# Altium project Unrouted_Pet_IOT_PCB.PrjPcb
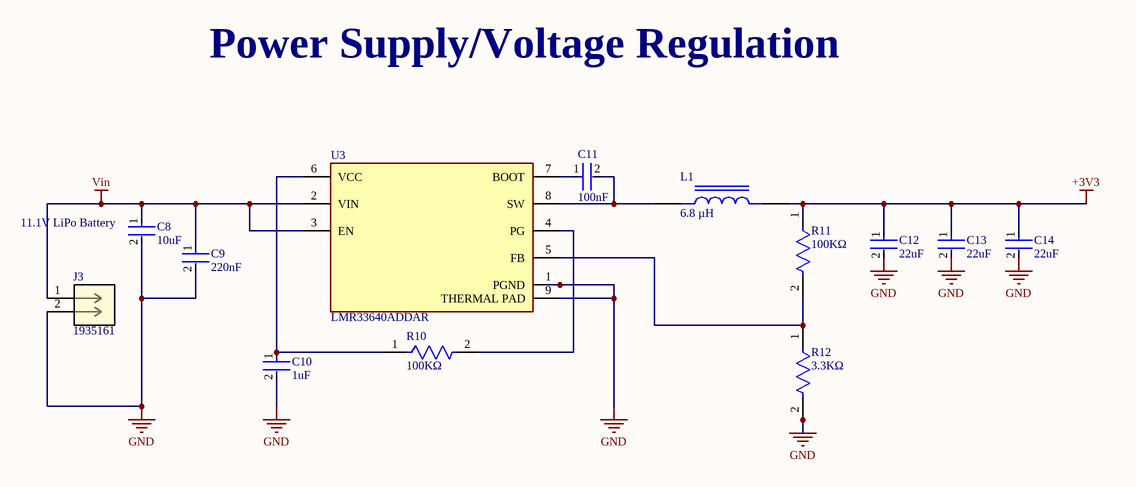
[diagram p0: PowerSupply.SchDoc]
3 sheets, 35 parts. Net scope: global (net labels, ports and power ports of the same name join across sheets).
Board file: PetTrackerPCB.PcbDoc
Sheets:
  PowerSupply.SchDoc
  Dataflow.SchDoc
  EC25.SchDoc

## Sheet PowerSupply.SchDoc
size A4; SheetNumber: 1; SheetTotal: 3

### Parts
C8  10uF  [FP-CL21-IPC_A]
C9  220nF  [FP-CL21-IPC_B]
C10  1uF  [FP-CL10-IPC_C]
C11  100nF  [FP-CL21-IPC_C]
C12  22uF  [FP-CL21-IPC_C]
C13  22uF  [FP-CL21-IPC_C]
C14  22uF  [FP-CL21-IPC_C]
J3  1935161  [CONN_1935161_PXC]
L1  6.8 µH  [IND_SRN8040TA-6R8M]
R10  100KΩ  [FP-CRGP2512-IPC_C]
R11  100KΩ  [FP-CRGP2512-IPC_C]
R12  3.3KΩ  [FP-CRGP2512-IPC_C]
U3  LMR33640ADDAR  [FP-DDA0008J-IPC_A]

### Nets
+3V3: C12.1 C13.1 C14.1 L1.2 R11.1
GND: C8.2 C9.2 C10.2 C12.2 C13.2 C14.2 J3.2 R12.2 U3.1(PGND) U3.9(THERMAL_PAD)
Vin: C8.1 C9.1 J3.1 U3.2(VIN) U3.3(EN)
NetC10_1: C10.1 R10.1 U3.6(VCC)
NetC11_1: C11.1 U3.7(BOOT)
NetC11_2: C11.2 L1.1 U3.8(SW)
NetR10_2: R10.2 U3.4(PG)
NetR11_2: R11.2 R12.1 U3.5(FB)

### Notes on the sheet
- Power Supply/Voltage Regulation
- (near C8) 11.1V LiPo Battery

### Library data of the parts
C8 = CMP-13271-002975-1: CL21A106KAYNNNE CL21 Series 0805 10uF 25V ±10% Tolerance X5R Multilayer Ceramic Chip Capacitor; Case Code (Imperial): 0805; Length: 2mm; Case/Package: 0805; Packaging: Tape and Reel; Width: 0.049inch; Tolerance: 10%; Mount: Surface Mount; Min Operating Temperature: -55°C; Thickness: 0.057inch; Height: 1.25mm; Dielectric: X5R; Package Quantity: 1; Depth: 1.25mm; Capacitance: 10uF; Voltage Rating: 25V; Case Code (Metric): 2012; Max Operating Temperature: 85°C; Radiation Hardening: No
C9 = CMP-13271-002523-1: CL21B224KAFNNNE CL21 Series 0805 220nF 25V ±10% Tolerance X7R Multilayer Ceramic Chip Capacitor; Depth: 1.25mm; Case/Package: 0805; Mount: Surface Mount; Length: 2mm; Voltage Rating: 25V; Dielectric: X7R; Max Operating Temperature: 125°C; Thickness: 0.053inch; Case Code (Metric): 2012; Capacitance: 220nF; Package Quantity: 1; Radiation Hardening: No; Height: 1.25mm; Tolerance: 10%; Contact Plating: Tin; Packaging: Tape and Reel; Case Code (Imperial): 0805; Min Operating Temperature: -55°C; Width: 0.049inch
C10 = CMP-13271-004127-1: CL10A105KA8NNNC Cap Ceramic 1uF 25V X5R ±10% Pad SMD 0603 +85°C T/R; Height: 0.8mm; Capacitance: 1uF; Depth: 0.8mm; Package Quantity: 1; Mount: Surface Mount; Contact Plating: Tin; Voltage Rating: 25V; Dielectric: X5R; Packaging: Tape and Reel; Material: Ceramic; Case Code (Metric): 1608; Length: 1.6mm; Voltage: 25V; Min Operating Temperature: -55°C; Width: 0.031inch; Tolerance: 10%; Case/Package: 0603; Radiation Hardening: No; Case Code (Imperial): 0603; Thickness: 0.035inch; Lead Free: Lead Free; Max Operating Temperature: 85°C; Voltage Rating (DC): 25V
C11 = CMP-13271-002854-1: CL21B104KACNNNC CL21 Series 0805 100nF 25V ±10% Tolerance X7R Multilayer Ceramic Chip Capacitor; Thickness: 0.037inch; Dielectric: X7R; Packaging: Tape and Reel; Height: 0.85mm; Case/Package: 0805; Mount: Surface Mount; Case Code (Imperial): 0805; Capacitance: 100nF; Case Code (Metric): 2012; Length: 2mm; Voltage Rating: 25V; Voltage: 25V; Contact Plating: Tin; Tolerance: 10%; Max Operating Temperature: 125°C; Width: 0.049inch; Min Operating Temperature: -55°C; Radiation Hardening: No; Package Quantity: 1; Depth: 1.25mm
C12-C14 = CMP-13271-003225-1: CL21A226MAYNNNE CL21 Series 0805 22uF 25V ±20% Tolerance X5R Multilayer Ceramic Chip Capacitor
J3 = 1935161: Ceramic Capacitor, Multilayer, Ceramic, 16V, 10% +Tol, 10% -Tol, X5R, 15% TC, 10uF, Surface Mount, 0805; Mfr_Name: Phoenix Contact; Manufacturer: Samsung; Manufacturer Part Number: CL21A106KOQNNNE; Multilayer: Yes; RefDes: RefDes; Type: Type; Supplier: Digikey; Supplier Part Number: 1276-1096-1-ND; RoHS: Yes; Category: Ceramic Capacitors; Stock: 3573508; Pricing: 1=0.1, 10=0.07, 50=0.0404, 100=0.0313, 500=0.02354, 1000=0.0185 (USD); Mounting Technology: Surface Mount; Pins: 2; Dielectric Material: Ceramic; Package Shape: Rectangular; Case/Package: 0805; Terminal Finish: Nickel; Min Operating Temperature: -55°C; Max Operating Temperature: 85°C; JESD-609 Code: e3; Value: 10uF; Capacitor Type: Ceramic; Tolerance  (fill in as +-): 10%; Package Style: SMTMeter; Packaging: Tape and Reel; Tolerance (fill in as +-): 10%; Rated DC Voltage (URdc): 16V; Temperature Characteristics Code: X5R; Termination: Wraparound; Length: 2mm; Width: 1.25mm; Height: 1.4mm; Reach SVHC Compliant: Yes; RoHS Compliant: Yes; ComponentLink1URL: https://datasheet.ciiva.com:443/pdfs/VipMasterIC/IC/SEMS/SEMS-S-A0008520559/SEMS-S-A0008520510-1.pdf?src-supplier=IHS+Markit; ComponentLink1Description: https://datasheet.ciiva.com:443/pdfs/VipMasterIC/IC/SEMS/SEMS-S-A0008520559/SEMS-S-A0008520510-1.pdf?src-supplier=IHS+Markit; ComponentLink2URL: https://datasheet.ciiva.com/15216/getdatasheetpartid-358435-15216234.pdf?src-supplier=Verical; ComponentLink2Description: https://datasheet.ciiva.com/15216/getdatasheetpartid-358435-15216234.pdf?src-supplier=Verical; ComponentLink3URL: https://datasheet.ciiva.com/25798/cl21a106koqnnne-25798133.pdf?src-supplier=Digikey; ComponentLink3Description: https://datasheet.ciiva.com/25798/cl21a106koqnnne-25798133.pdf?src-supplier=Digikey
L1 = SRN8040TA-6R8M: SRN8040TA-6R8M FIXED IND 6.8UH 5.1A 25 MOHM SMD; Package: None; Price: None; Value: *; MP: SRN8040TA-6R8M; Availability: Unavailable
R10 R11 = CMP-03211-001791-1: CRGP2512F100K CRGP2512 100KΩ 2W ±100ppm/°C 1% 500V; Manufacturer: TE; Tolerance: 0.01; Ambient Temperature Range High: +70°C; Package: CRGP2512; Lead Free: Yes; ComponentLink2URL: https://www.mouser.ca/datasheet/2/418/NG_DS_9-1773463-9_A-1358566.pdf; Device Class L2: Resistors; Ipc Land Pattern Name: RESC635320X55; Temperature Coefficient: ±100ppm/°C; Voltage Rating: 500V; Temperature: -55°C to +155°C; Category: Res; Composition: Thick Film; Octopart: https://octopart.com/crgp2512f100k-te+connectivity-91019024; RoHS: TRUE; Power Rating: 2W; Device Class L1: Passive Components; Temperature Range High: +155°C; Temperature Range Low: -55°C; Series: CRGP; Device Class L3: Chip SMD Resistors; Manufacturer Part Number: CRGP2512F100K; Height: 0.65mm; Resistance: 100KΩ; Value: 100KΩ; ComponentLink2Description: Datasheet; Automotive: No
R12 = CMP-03211-004979-1: CRGP2512F3K3 CRGP2512 3.3KΩ 2W ±100ppm/°C 1% 500V; Manufacturer: TE; Tolerance: 0.01; Height: 0.65mm; RoHS: TRUE; Power Rating: 2W; Package: CRGP2512; Device Class L3: Chip SMD Resistors; Temperature Coefficient: ±100ppm/°C; Lead Free: Yes; Automotive: No; Category: Res; Octopart: https://octopart.com/crgp2512f3k3-te+connectivity-91019064; Composition: Thick Film; Series: CRGP; Resistance: 3.3KΩ; Temperature Range High: +155°C; Ambient Temperature Range High: +70°C; Manufacturer Part Number: CRGP2512F3K3; Temperature Range Low: -55°C; Device Class L2: Resistors; Value: 3.3KΩ; Temperature: -55°C to +155°C; ComponentLink2URL: https://www.mouser.ca/datasheet/2/418/NG_DS_9-1773463-9_A-1358566.pdf; Ipc Land Pattern Name: RESC635320X55; Voltage Rating: 500V; Device Class L1: Passive Components; ComponentLink2Description: Datasheet
U3 = CMP-04918-000399-1: 36V 4A 400KHZ REGULATOR

## Sheet Dataflow.SchDoc
size A3; SheetNumber: 2; SheetTotal: 3
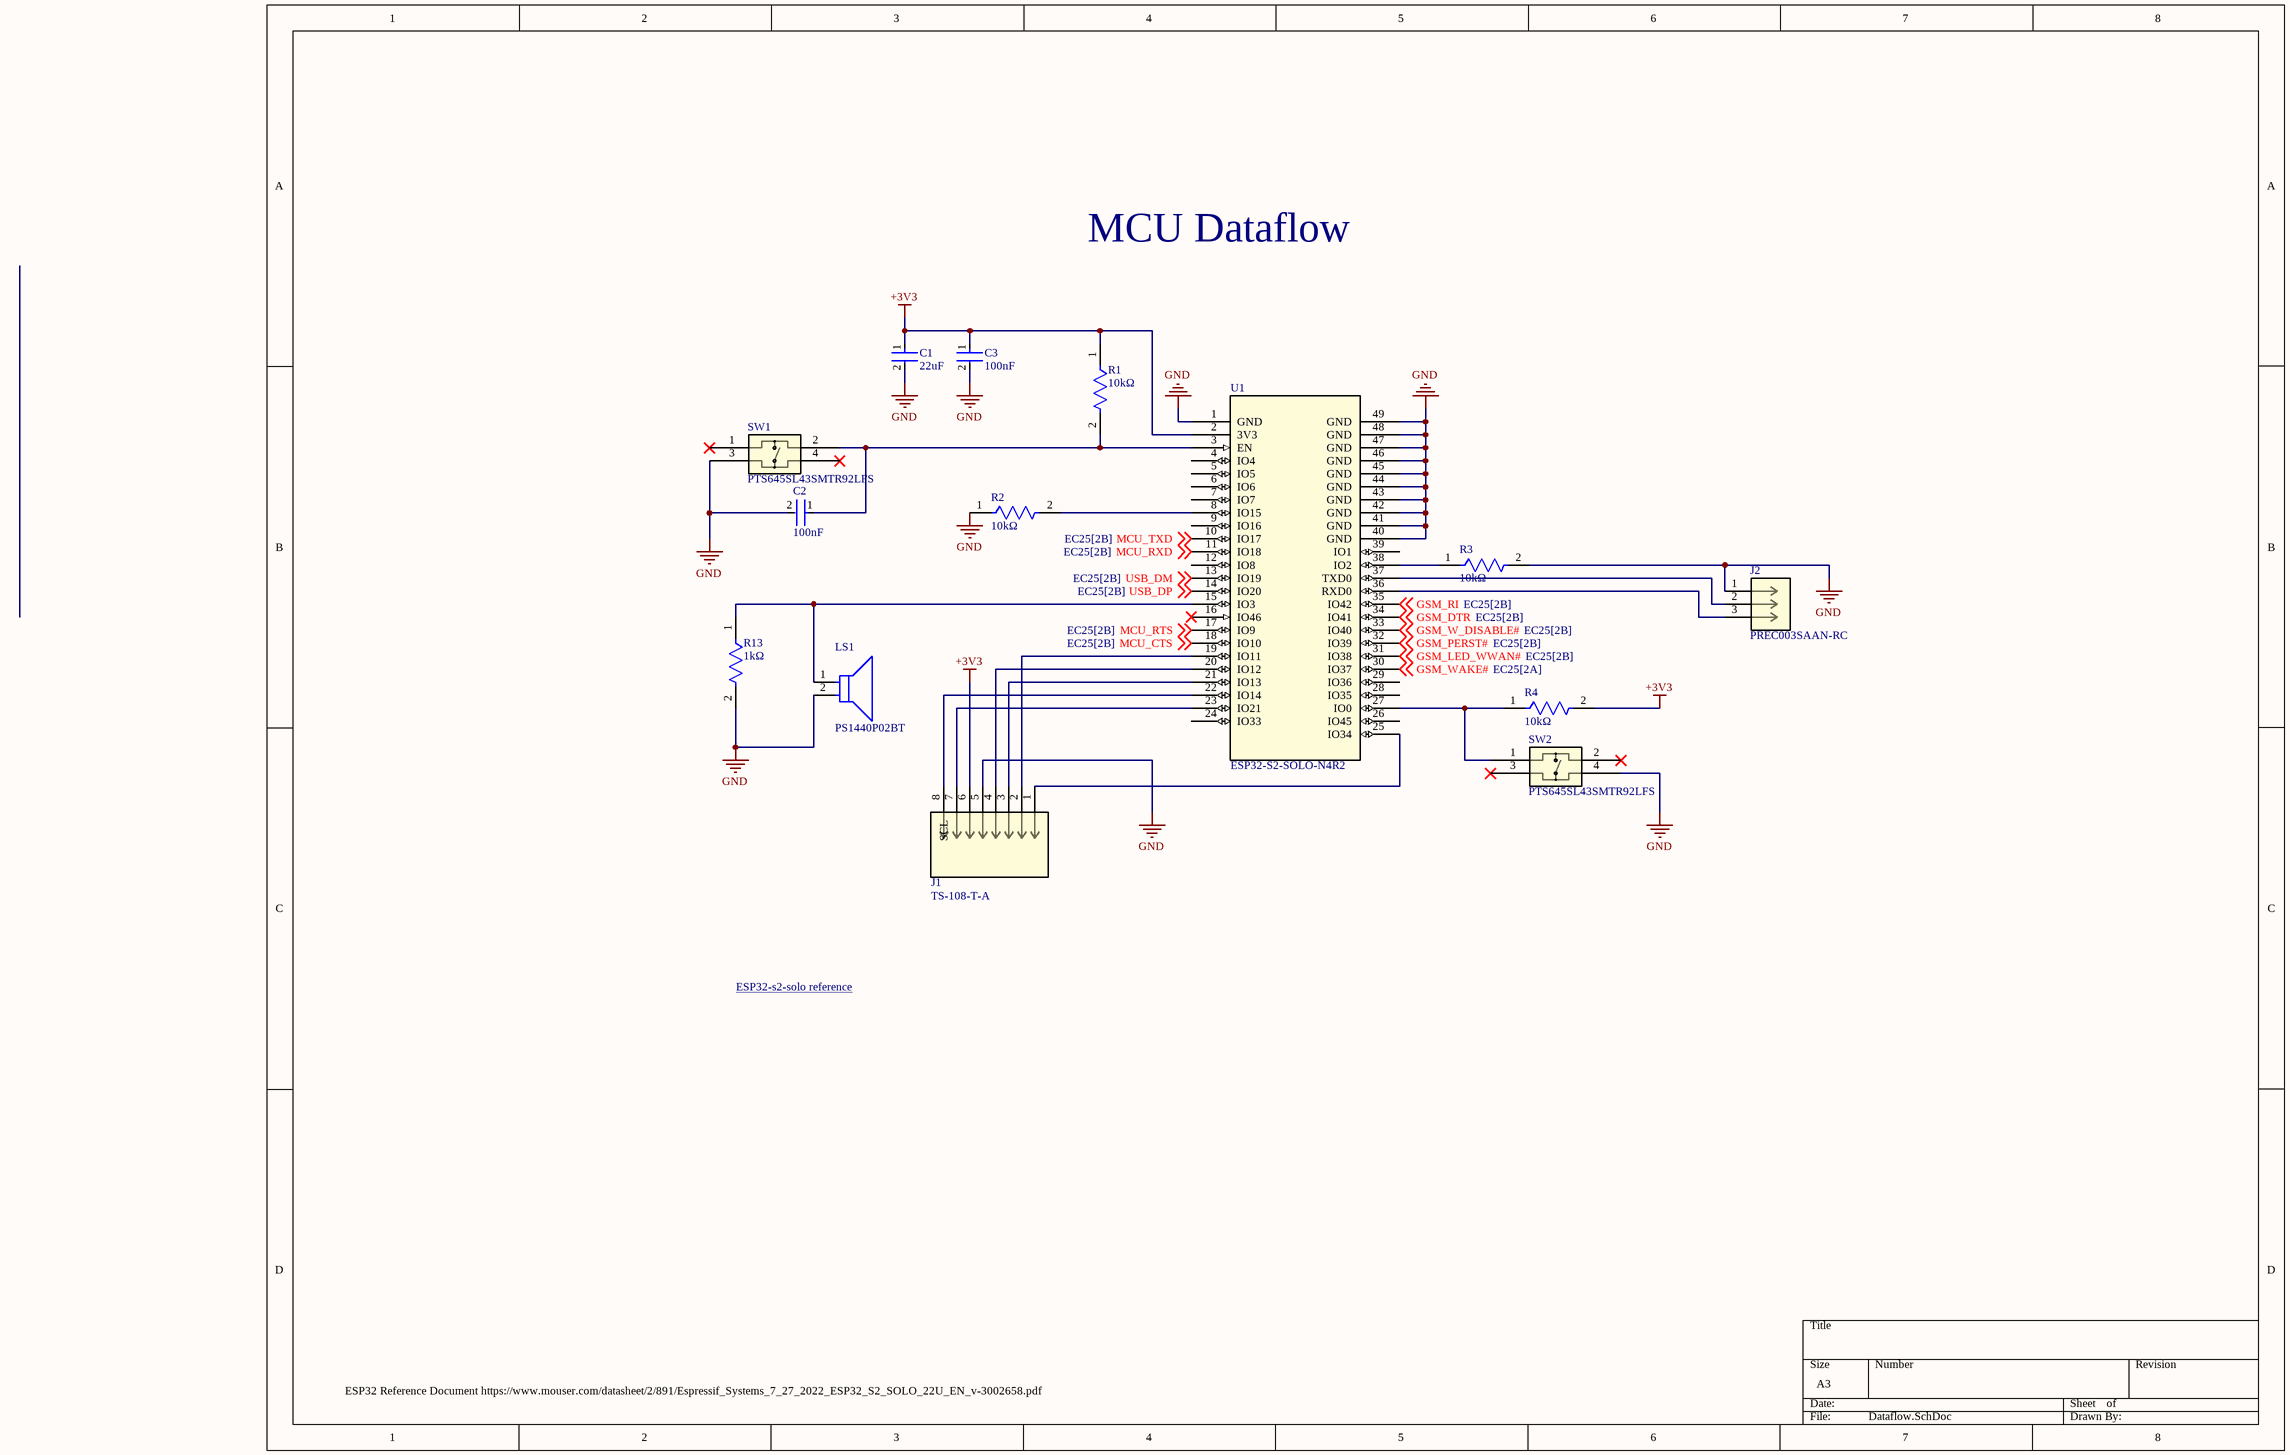
[diagram p1: Dataflow.SchDoc]

### Parts
C1  22uF  [FP-CL21-IPC_C]
C2  100nF  [FP-CL21-IPC_C]
C3  100nF  [FP-CL21-IPC_C]
J1  TS-108-T-A  [CON8_1X8_TU_HTS_SAI]
J2  PREC003SAAN-RC  [CONN_PREC003SAAN-RC_SUL]
LS1  PS1440P02BT  [FP-PS1440P02BT-MFG]
R1  10kΩ  [FP-CRGP2512-IPC_C]
R2  10kΩ  [FP-CRGP2512-IPC_C]
R3  10kΩ  [FP-CRGP2512-IPC_C]
R4  10kΩ  [FP-CRGP2512-IPC_C]
R13  1kΩ  [FP-CRGP2512-IPC_C]
SW1  PTS645SL43SMTR92LFS  [PTS645SL43SMTR92LFS_CNK]
SW2  PTS645SL43SMTR92LFS  [PTS645SL43SMTR92LFS_CNK]
U1  ESP32-S2-SOLO-N4R2  [MOD41_ESP32-S2-SOLO_EXP]

### Nets
+3V3: C1.1 C3.1 J1.6(+3V3) R1.1 R4.2 U1.2(3V3)
GND: C1.2 C2.2 C3.2 J1.5(GND) J2.1 LS1.2 R2.1 R3.2 R13.2 SW1.3 SW2.4 U1.1(GND) U1.40(GND) U1.41(GND) U1.42(GND) U1.43(GND) U1.44(GND) U1.45(GND) U1.46(GND) U1.47(GND) U1.48(GND) U1.49(GND)
GSM_DTR: U1.34(IO41) ; off-sheet GSM_DTR
GSM_LED_WWAN#: U1.31(IO38) ; off-sheet GSM_LED_WWAN#
GSM_PERST#: U1.32(IO39) ; off-sheet GSM_PERST#
GSM_RI: U1.35(IO42) ; off-sheet GSM_RI
GSM_W_DISABLE#: U1.33(IO40) ; off-sheet GSM_W_DISABLE#
GSM_WAKE#: U1.30(IO37) ; off-sheet GSM_WAKE#
MCU_CTS: U1.18(IO10) ; off-sheet MCU_CTS
MCU_RTS: U1.17(IO9) ; off-sheet MCU_RTS
MCU_RXD: U1.11(IO18) ; off-sheet MCU_RXD
MCU_TXD: U1.10(IO17) ; off-sheet MCU_TXD
USB_DM: U1.13(IO19) ; off-sheet USB_DM
USB_DP: U1.14(IO20) ; off-sheet USB_DP
NetC2_1: C2.1 R1.2 SW1.2 U1.3(EN)
NetJ1_1: J1.1(CS) U1.25(IO34)
NetJ1_2: J1.2(MOSI) U1.19(IO11)
NetJ1_3: J1.3(MISO) U1.21(IO13)
NetJ1_4: J1.4(SCLK) U1.20(IO12)
NetJ1_7: J1.7(SDA) U1.23(IO21)
NetJ1_8: J1.8(SCL) U1.22(IO14)
NetJ2_2: J2.2 U1.37(TXD0)
NetJ2_3: J2.3 U1.36(RXD0)
NetLS1_1: LS1.1 R13.1 U1.15(IO3)
NetR2_2: R2.2 U1.8(IO15)
NetR3_1: R3.1 U1.38(IO2)
NetR4_1: R4.1 SW2.1 U1.27(IO0)

Not connected (* = marked no-connect by the designer): SW1 1* 4*; SW2 2* 3*; U1 4(IO4) 5(IO5) 6(IO6) 7(IO7) 9(IO16) 12(IO8) 16(IO46)* 24(IO33) 26(IO45) 28(IO35) 29(IO36) 39(IO1)

### Notes on the sheet
- MCU Dataflow
- ESP32-s2-solo reference <https://www.espressif.com/sites/default/files/documentation/esp32-s2-solo-2_esp32-s2-solo-2u_datasheet_en.pdf>
- ESP32 Reference Document https://www.mouser.com/datasheet/2/891/Espressif_Systems_7_27_2022_ESP32_S2_SOLO_22U_EN_v-3002658.pdf

### Library data of the parts
C1 = CMP-13271-003225-1: as C12 on sheet PowerSupply
C2 C3 = CMP-13271-002854-1: as C11 on sheet PowerSupply; Thickness: 0.037inch; Dielectric: X7R; Packaging: Tape and Reel; Height: 0.85mm; Case/Package: 0805; Mount: Surface Mount; Case Code (Imperial): 0805; Capacitance: 100nF; Case Code (Metric): 2012; Length: 2mm; Voltage Rating: 25V; Voltage: 25V; Contact Plating: Tin; Tolerance: 10%; Max Operating Temperature: 125°C; Width: 0.049inch; Min Operating Temperature: -55°C; Radiation Hardening: No; Package Quantity: 1; Depth: 1.25mm
J1 = TS-108-T-A: No Description Available; Mfr_Name: Samtec Inc; RefDes: RefDes; Type: Type
J2 = PREC003SAAN-RC: No Description Available; Mfr_Name: Sullins; Digi-Key_Part_Number_1: S1012EC-03-ND; RefDes: RefDes; Type: Type
LS1 = CMP-08413-000003-1: AUDIO PIEZO TRANSDUCER 30V TH; Self Resonant Frequency: 4kHz; Washable: No; Voltage Rating (DC): 3V; Number of Terminals/Pins: 2; Packaging: Tape and Reel; Lead Free: Lead Free; Min Operating Temperature: -10°C; Package Quantity: 350; Termination: PC Pins; Mount: Through Hole; Max Operating Temperature: 70°C; Operating Supply Voltage: 3V; Diameter: 14mm; RoHS Compliant: Yes; Frequency: 4kHz; Height: 8mm
R1-R4 = CMP-03211-007941-1: CRGP2512F10K CRGP 2512 10K 1%; Manufacturer: TE; Voltage Rating: 500V; Tolerance: 0.01; Temperature Coefficient: ±100ppm/°C; Description: CRGP2512 10KΩ 2W ±100ppm/°C 1% 500V; Power Rating: 2W; ComponentLink2Description: Datasheet; Series: CRGP; Temperature: -55°C to +155°C; ComponentLink2URL: https://www.mouser.ca/datasheet/2/418/NG_DS_9-1773463-9_A-1358566.pdf; Device Class L3: Chip SMD Resistors; Temperature Range High: +155°C; Ipc Land Pattern Name: RESC635320X55; Manufacturer Part Number: CRGP2512F10K; Height: 0.65mm; RoHS: TRUE; Ambient Temperature Range High: +70°C; Lead Free: Yes; Composition: Thick Film; Device Class L1: Passive Components; Automotive: No; Octopart: https://octopart.com/crgp2512f10k-te+connectivity-91019026; Digikey Description: CRGP 2512 10K 1%; Value: 10KΩ; Package: CRGP2512; Temperature Range Low: -55°C; Resistance: 10KΩ; Category: Res; Device Class L2: Resistors
R13 = CMP-03211-007859-1: CRGP2512F1K0 Res, 1K, 1%, 2W, 2512, Thick Film; Manufacturer: TE; Temperature Coefficient: ±100ppm/°C; Voltage Rating: 500V; Description: CRGP2512 1KΩ 2W ±100ppm/°C 1% 500V; Tolerance: 0.01; Power Rating: 2W; Composition: Thick Film; Temperature Range Low: -55°C; Device Class L3: Chip SMD Resistors; Value: 1KΩ; Device Class L2: Resistors; Device Class L1: Passive Components; Temperature: -55°C to +155°C; Category: Res; Automotive: No; Manufacturer Part Number: CRGP2512F1K0; Ipc Land Pattern Name: RESC635320X55; Digikey Description: Res, 1K, 1%, 2W, 2512, Thick Film; Height: 0.65mm; Octopart: https://octopart.com/crgp2512f1k0-te+connectivity-91019040; Package: CRGP2512; Series: CRGP; Ambient Temperature Range High: +70°C; Lead Free: Yes; Resistance: 1KΩ; Temperature Range High: +155°C; RoHS: TRUE; ComponentLink2Description: Datasheet; ComponentLink2URL: https://www.mouser.ca/datasheet/2/418/NG_DS_9-1773463-9_A-1358566.pdf
SW1 SW2 = PTS645SL43SMTR92LFS: No Description Available; Mfr_Name: C&K Components; RefDes: RefDes; Type: Type
U1 = ESP32-S2-SOLO-N4R2: No Description Available; Mfr_Name: Espressif Systems; Type: RF; RefDes: RefDes

## Sheet EC25.SchDoc
size A4; SheetNumber: 3; SheetTotal: 3
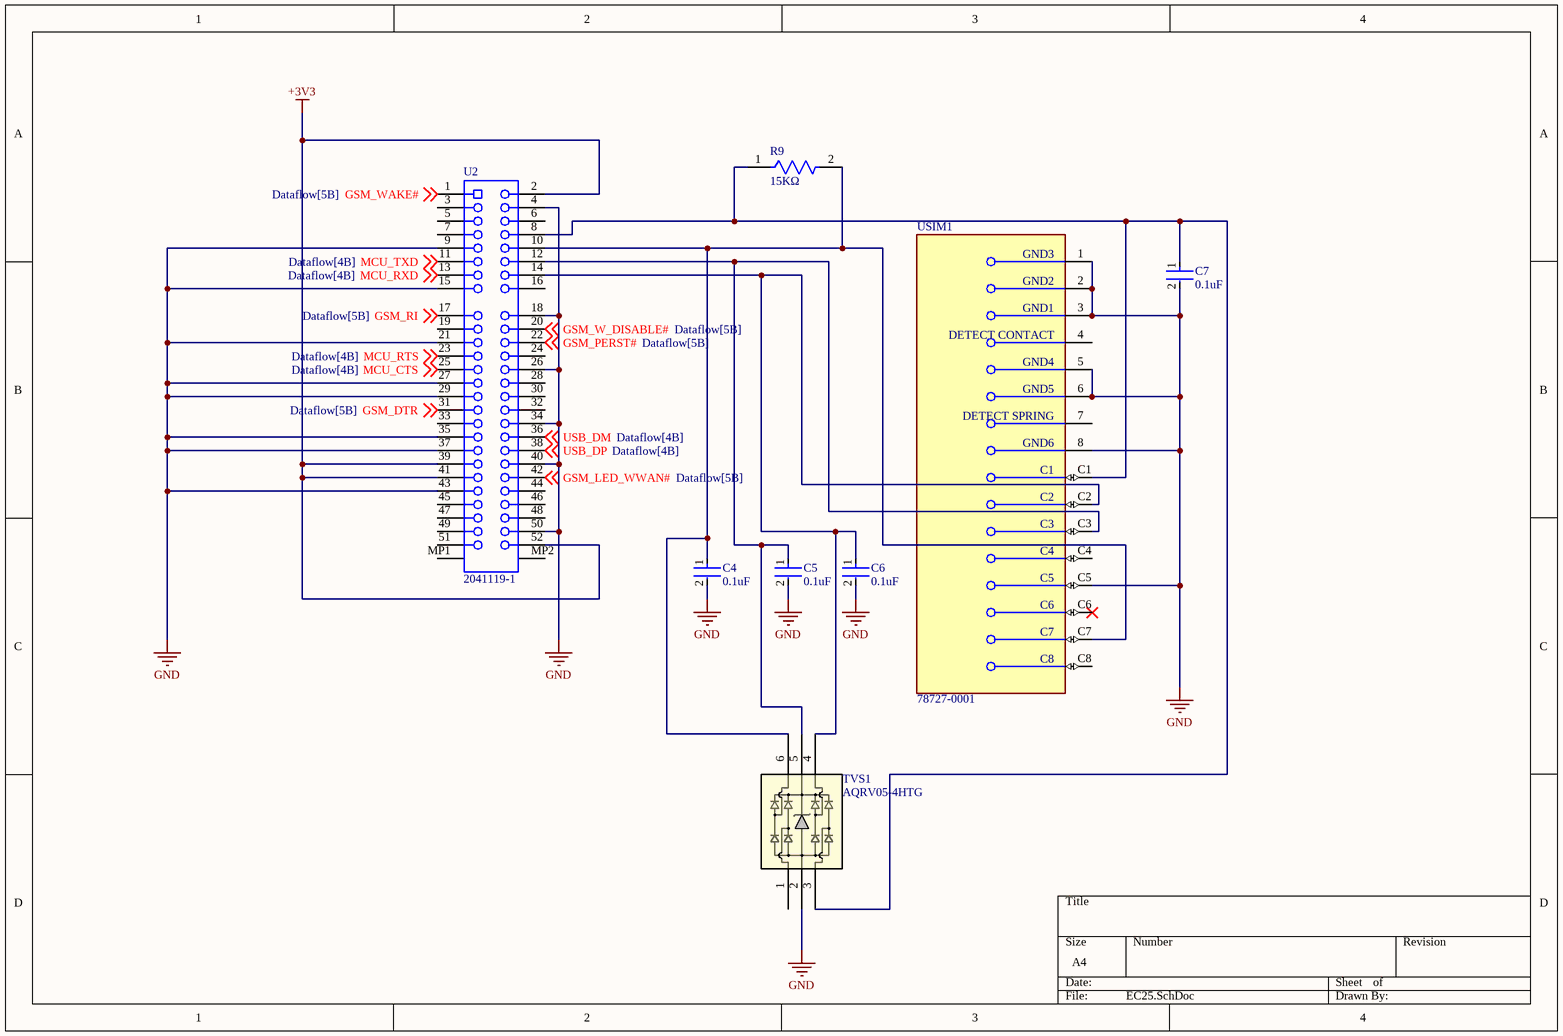
[diagram p2: EC25.SchDoc]

### Parts
C4  0.1uF  [FP-C0603C-CF-MFG]
C5  0.1uF  [FP-C0603C-CF-MFG]
C6  0.1uF  [FP-C0603C-CF-MFG]
C7  0.1uF  [FP-C0603C-CF-MFG]
R9  15KΩ  [FP-CRGP2512-IPC_C]
TVS1  AQRV05-4HTG  [SOT23-6_LTF]
U2  2041119-1  [TECO-2041119-1_3_V]
USIM1  78727-0001  [FP-78727-0001-MFG]

### Nets
+3V3: U2.2 U2.39 U2.41 U2.52
GND: C4.2 C5.2 C6.2 C7.2 TVS1.2 U2.4 U2.9 U2.15 U2.18 U2.21 U2.26 U2.27 U2.29 U2.34 U2.35 U2.37 U2.40 U2.43 U2.50 USIM1.1(GND3) USIM1.2(GND2) USIM1.3(GND1) USIM1.5(GND4) USIM1.6(GND5) USIM1.8(GND6) USIM1.C5
GSM_DTR: U2.31 ; off-sheet GSM_DTR
GSM_LED_WWAN#: U2.42 ; off-sheet GSM_LED_WWAN#
GSM_PERST#: U2.22 ; off-sheet GSM_PERST#
GSM_RI: U2.17 ; off-sheet GSM_RI
GSM_W_DISABLE#: U2.20 ; off-sheet GSM_W_DISABLE#
GSM_WAKE#: U2.1 ; off-sheet GSM_WAKE#
MCU_CTS: U2.25 ; off-sheet MCU_CTS
MCU_RTS: U2.23 ; off-sheet MCU_RTS
MCU_RXD: U2.13 ; off-sheet MCU_RXD
MCU_TXD: U2.11 ; off-sheet MCU_TXD
USB_DM: U2.36 ; off-sheet USB_DM
USB_DP: U2.38 ; off-sheet USB_DP
NetC4_1: C4.1 R9.2 TVS1.6 U2.10 USIM1.C7
NetC5_1: C5.1 TVS1.5 U2.12 USIM1.C3
NetC6_1: C6.1 TVS1.4 U2.14 USIM1.C2
NetC7_1: C7.1 R9.1 TVS1.3 U2.8 USIM1.C1

Not connected (* = marked no-connect by the designer): TVS1 1; U2 3 5 6 7 16 19 24 28 30 32 33 44 45 46 47 48 49 51 MP1 MP2; USIM1 4(DETECT_CONTACT) 7(DETECT_SPRING) C4 C6* C8

### Library data of the parts
C4-C7 = CMP-2006-03056-2: C0603C104J5RACTU CAP CER 0.1UF 50V 5% X7R 0603; Manufacturer: KEMET; Automotive Grade: Grade 1; Tolerance: 0.05; Capacitance: 0.10 μF; Value: 0.10 μF; Material: Ceramic; Temperature Coefficient: 30ppm/°C; ComponentLink2Description: Datasheet; Voltage Rating: 50 V; Digikey Description: CAP CER 0.1UF 50V 5% X7R 0603; Manufacturer Part Number: C0603C104J5RACTU; Temperature Range High: +125°C; Device Class L2: Capacitors; Octopart: https://octopart.com/c0603c104j5ractu-kemet-10440638; RoHS: TRUE; Mouser Description: Multilayer Ceramic Capacitors MLCC - SMD/SMT 50volts 0.1uF X7R 5%; Temperature Range Low: -55°C; Automotive: Yes; Lead Free: Yes; ComponentLink2URL: https://api.kemet.com/component-edge/download/datasheet/C0603C100J5GACAUTO.pdf; Device Class L3: Ceramic Capacitors; Package: C0603C-CF; Category: Cap; Temperature: -55°C to +125°C; Height: 0.87mm; Temperature Characteristic: X7R; Device Class L1: Passive Components
R9 = CMP-03211-008564-1: CRGP2512F15K CRGP2512 15KΩ 2W ±100ppm/°C 1% 500V; Manufacturer: TE; Tolerance: 0.01; Temperature Coefficient: ±100ppm/°C; Manufacturer Part Number: CRGP2512F15K; Automotive: No; Resistance: 15KΩ; Temperature: -55°C to +155°C; ComponentLink2URL: https://www.mouser.ca/datasheet/2/418/NG_DS_9-1773463-9_A-1358566.pdf; Voltage Rating: 500V; RoHS: TRUE; Device Class L1: Passive Components; Ipc Land Pattern Name: RESC635320X55; Composition: Thick Film; Ambient Temperature Range High: +70°C; Height: 0.65mm; Package: CRGP2512; Lead Free: Yes; Power Rating: 2W; Device Class L2: Resistors; Category: Res; ComponentLink2Description: Datasheet; Value: 15KΩ; Temperature Range High: +155°C; Octopart: https://octopart.com/crgp2512f15k-te+connectivity-91019034; Description: CRGP2512 15KΩ 2W ±100ppm/°C 1% 500V; Temperature Range Low: -55°C; Device Class L3: Chip SMD Resistors; Series: CRGP
TVS1 = AQRV05-4HTG: No Description Available; Mfr_Name: Littelfuse Inc; RefDes: RefDes; Type: Type
U2 = CMP-2011-00000-2: mSATA & PCI Express Mini Card Connector, Pitch 0.4 mm, 52 Position, Height 4 mm, RoHS, Tape and Reel; Manufacturer: TE Connectivity; Case\Package: SMD; Rows: 2; Contacts: 52; Contact Material: Copper; Orientation: RightAngle; Width: 9.02mm; Mounting Technology: SurfaceMount; ELV: Compliant; Contact Plating: Gold; Termination: Solder; Datasheet URL: http://www.te.com/commerce/DocumentDelivery/DDEController?Action=showdoc&DocId=Customer+Drawing%7F2041119%7FD%7Fpdf%7FEnglish%7FENG_CD_2041119_D.pdf%7F2041119-1; Height: 4mm; Manufacturer URL: http://www.te.com/; Datasheet Version: 06/2016; RoHSCompliant: true; Length: 29.9mm; Package Description: mSATA & PCI Express Mini Card Connector, Pitch 0.4 mm, 52 Position, Height 4 mm; Housing Colour: Black; Housing Material: Polymer; Packaging: TapeandReel; Mount: SurfaceMount; Radiation Hardening: No; Package Reference: 2041119-1_3; Poles: 52
USIM1 = CMP-04763-000002-1: CONN MICRO SIM CARD PUSH-PULL; Manufacturer: Molex; Voltage Rating: 10V; Is Female: yes; Current Rating: 0.5A; Conn Orientation: Horizontal; Number Of Contacts: 6; Pitch: 2.54mm; Shielding: true; Octopart: https://octopart.com/78727-0001-molex-24436211; Manufacturer Part Number: 78727-0001; Temperature Range High: +85°C; Temperature Range Low: -40°C; ComponentLink2Description: Datasheet; Digikey Description: CONN MICRO SIM CARD PUSH-PULL; Temperature: -40°C to +85°C; Device Class L1: Connectors; Category: Conn; Device Class L2: Memory Connectors; Package: 78727-0001; Contact Material: Gold,Nickel; Footprint Url: https://www.molex.com/pdm_docs/sd/787270001_sd.pdf; Automotive: No; RoHS: TRUE; Mouser Description: Micro-SIM Card holder Temperature range: -40 ... +85 °C Contact material: Copper Poles: 6; Lead Free: Yes; Height: 1.52mm; ComponentLink2URL: https://www.molex.com/webdocs/datasheets/pdf/en-us/0787270001_MEMORY_CARD_SOCKET.pdf; Device Class L3: unset

## Nets that join several sheets
+3V3: PowerSupply (5 pins), Dataflow (6 pins), EC25 (U2.2 U2.39 U2.41 U2.52)
GND: PowerSupply (10 pins), Dataflow (22 pins), EC25 (26 pins)
GSM_DTR: Dataflow (U1.34), EC25 (U2.31)
GSM_LED_WWAN#: Dataflow (U1.31), EC25 (U2.42)
GSM_PERST#: Dataflow (U1.32), EC25 (U2.22)
GSM_RI: Dataflow (U1.35), EC25 (U2.17)
GSM_W_DISABLE#: Dataflow (U1.33), EC25 (U2.20)
GSM_WAKE#: Dataflow (U1.30), EC25 (U2.1)
MCU_CTS: Dataflow (U1.18), EC25 (U2.25)
MCU_RTS: Dataflow (U1.17), EC25 (U2.23)
MCU_RXD: Dataflow (U1.11), EC25 (U2.13)
MCU_TXD: Dataflow (U1.10), EC25 (U2.11)
USB_DM: Dataflow (U1.13), EC25 (U2.36)
USB_DP: Dataflow (U1.14), EC25 (U2.38)